# Altium schematic sheet PA_group.SchDoc
size A4
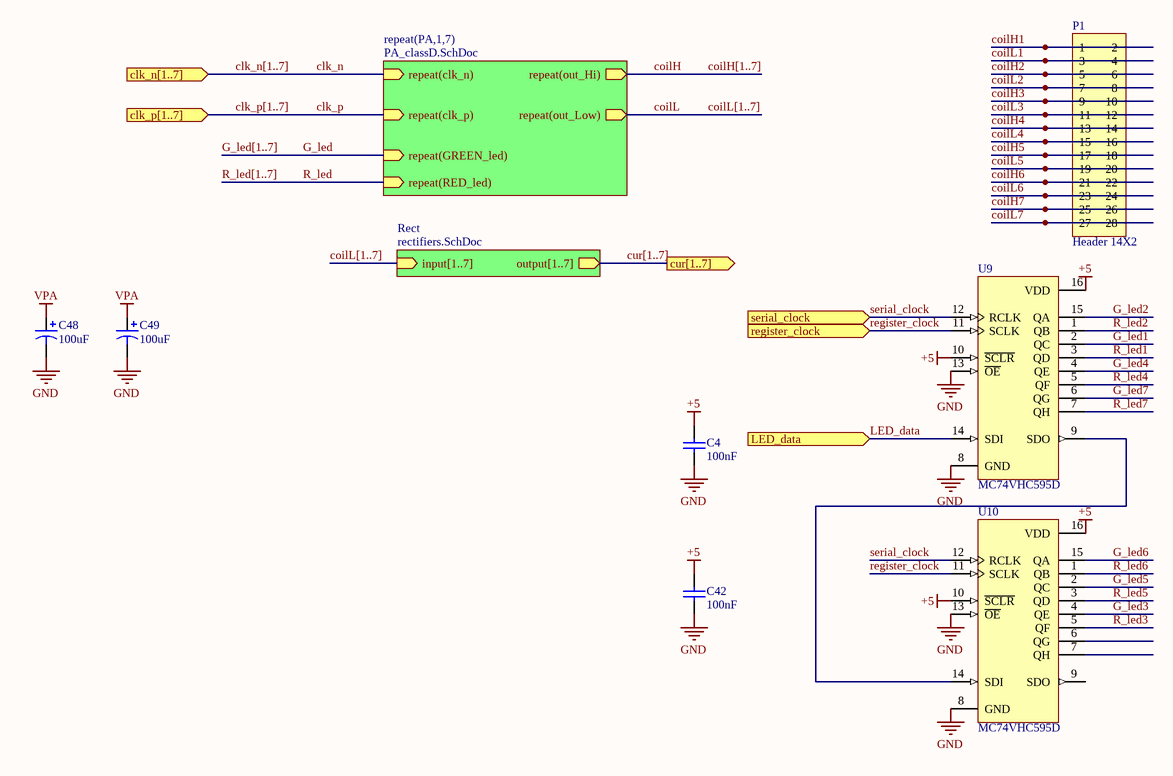
[diagram p0: PA_group.SchDoc]

## Parts
C4  value 100nF  [SMD_CAP_0805]  (hidden comment: Cap)
C42  value 100nF  [SMD_CAP_0805]  (hidden comment: Cap)
C48  value 100uF  [Cap SMD electrolite-6.3mm]
C49  value 100uF  [Cap SMD electrolite-6.3mm]
P1  Header 14X2  [HDR2X14]
U9  MC74VHC595D  [751B-05_N]
U10  MC74VHC595D  [751B-05_N]

## Sub-sheets
Rect = rectifiers.SchDoc: input[1..7] (in), output[1..7] (out)
repeat(PA,1,7) = PA_classD.SchDoc: repeat(clk_n) (in), repeat(clk_p) (in), repeat(out_Hi) (out), repeat(out_Low) (out), repeat(GREEN_led) (in), repeat(RED_led) (in)

## Ports
clk_n[1..7] (in), clk_p[1..7] (in), cur[1..7] (out), LED_data (in), register_clock (in), serial_clock (in)

## Nets
+5: C4.1 C42.1 U9.10(~{SCLR}) U9.16(VDD) U10.10(~{SCLR}) U10.16(VDD)
GND: C4.2 C42.2 C48.2 C49.2 U9.8(GND) U9.13(~{OE}) U10.8(GND) U10.13(~{OE})
VPA: C48.1 C49.1
clk_n: sheet repeat(PA,1,7)/repeat(clk_n)
clk_p: sheet repeat(PA,1,7)/repeat(clk_p)
coilH: sheet repeat(PA,1,7)/repeat(out_Hi)
coilH1: P1.1 P1.2
coilH2: P1.5 P1.6
coilH3: P1.9 P1.10
coilH4: P1.13 P1.14
coilH5: P1.17 P1.18
coilH6: P1.21 P1.22
coilH7: P1.25 P1.26
coilL: sheet repeat(PA,1,7)/repeat(out_Low)
coilL1: P1.3 P1.4
coilL2: P1.7 P1.8
coilL3: P1.11 P1.12
coilL4: P1.15 P1.16
coilL5: P1.19 P1.20
coilL6: P1.23 P1.24
coilL7: P1.27 P1.28
G_led: sheet repeat(PA,1,7)/repeat(GREEN_led)
G_led1: U9.2(QC)
G_led2: U9.15(QA)
G_led3: U10.4(QE)
G_led4: U9.4(QE)
G_led5: U10.2(QC)
G_led6: U10.15(QA)
G_led7: U9.6(QG)
LED_data: U9.14(SDI) ; port LED_data
R_led: sheet repeat(PA,1,7)/repeat(RED_led)
R_led1: U9.3(QD)
R_led2: U9.1(QB)
R_led3: U10.5(QF)
R_led4: U9.5(QF)
R_led5: U10.3(QD)
R_led6: U10.1(QB)
R_led7: U9.7(QH)
register_clock: U9.11(SCLK) U10.11(SCLK) ; port register_clock
serial_clock: U9.12(RCLK) U10.12(RCLK) ; port serial_clock
NetU9_9: U9.9(SDO) U10.14(SDI)

Not connected (* = marked no-connect by the designer): U10 6(QG) 7(QH) 9(SDO)

## Buses and harness runs
bus clk_n[1..7] = port clk_n[1..7]
bus clk_p[1..7] = port clk_p[1..7]
bus coilH[1..7]
bus coilL[1..7]
bus coilL[1..7] = sheet Rect/input[1..7]
bus cur[1..7] = port cur[1..7] = sheet Rect/output[1..7]
bus G_led[1..7]
bus R_led[1..7]

## Library data of the parts
C4 C42 = Cap ceramic: CAP-100Nf
C48 C49 = Cap Pol1: Polarized Capacitor (Radial); Published: 8-Jun-2000; LatestRevisionDate: 17-Jul-2002; LatestRevisionNote: Re-released for DXP Platform.; PackageReference: RB7.6-15; Publisher: Altium Limited; PackageDescription: Polarized Capacitor (Radial); 2 Leads
P1 = Header 14X2: Header, 14-Pin, Dual row; LatestRevisionDate: 17-Jul-2002; LatestRevisionNote: Re-released for DXP Platform.; Publisher: Altium Limited
U9 U10 = MC74VHC595D: 8-Bit 3-State Shift Register with Output Storage Register; ComponentAvailability: Not for New Design; Published: 15-Apr-2002; LatestRevisionDate: 13-Apr-2006; LatestRevisionNote: IPC-7351 Footprint Added.; DatasheetVersion: 1997; PackageVersion: Oct-1999; PackageReference: 751B-05; Publisher: Altium Limited; PackageDescription: 16-Pin Small Outline Integrated Circuit 1.27 mm Pitch; Code_JEDEC: MS-012-AC; Code_IPC: SOIC127P600-16; ComponentLink1Description: Manufacturer Link; ComponentLink1URL: http://www.onsemi.com/; ComponentLink2Description: Datasheet; ComponentLink2URL: http://www.onsemi.com/pub/Collateral/MC74VHC595-D.PDF